# Altium schematic sheet ESP32.SchDoc
size 431 x 279 mm; Author: Shivam Sharma; SheetNumber: 7; SheetTotal: 13
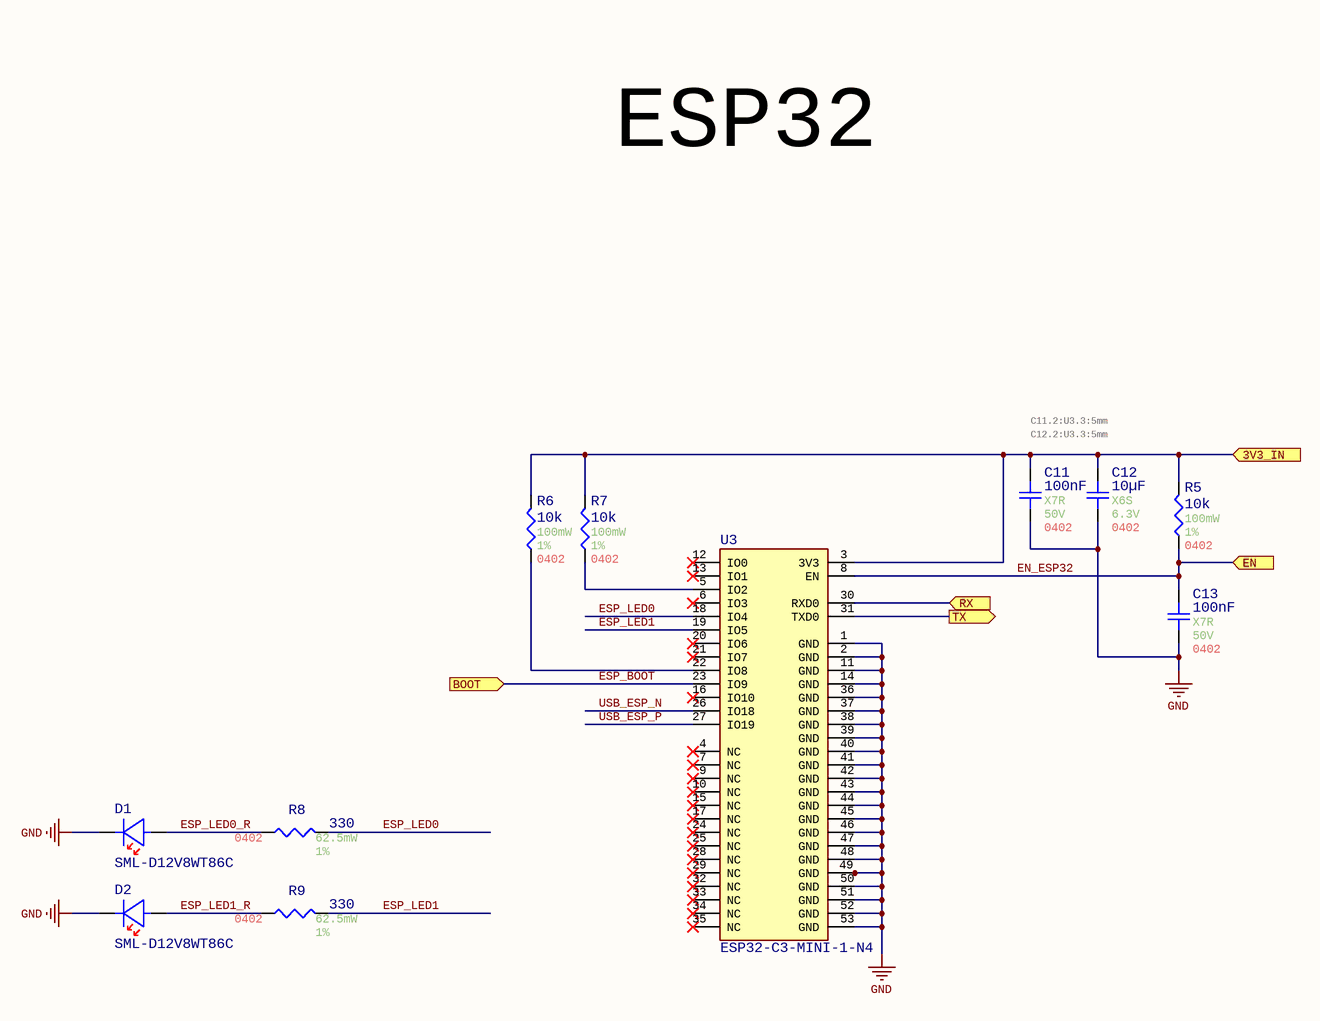
[diagram p0: ESP32.SchDoc]

## Parts
C11  value 100nF  Temperature Coefficient: X7R  Voltage Rating: 50V  Case/Package: 0402  PlaceNear: C11.2:U3.3:5mm  [Generic 0402 capacitor]  (hidden comment: GRT155R71H104KE01D)
C12  value 10µF  Temperature Coefficient: X6S  Voltage Rating: 6.3V  Case/Package: 0402  PlaceNear: C12.2:U3.3:5mm  [Generic 0402 capacitor]  (hidden comment: GRT155C80J106ME13J)
C13  value 100nF  Temperature Coefficient: X7R  Voltage Rating: 50V  Case/Package: 0402  [Generic 0402 capacitor]  (hidden comment: GRT155R71H104KE01D)
D1  SML-D12V8WT86C  [FP-SML-D12-MFG]
D2  SML-D12V8WT86C  [FP-SML-D12-MFG]
R5  value 10k  Power: 100mW  Tolerance: 1%  Case/Package: 0402  [Generic 0402 Resistor]  (hidden comment: RNCP0402FTD10K0)
R6  value 10k  Power: 100mW  Tolerance: 1%  Case/Package: 0402  [Generic 0402 Resistor]  (hidden comment: RNCP0402FTD10K0)
R7  value 10k  Power: 100mW  Tolerance: 1%  Case/Package: 0402  [Generic 0402 Resistor]  (hidden comment: RNCP0402FTD10K0)
R8  value 330  Power: 62.5mW  Tolerance: 1%  Case/Package: 0402  [Generic 0402 Resistor]  (hidden comment: RMCF0402FT330R)
R9  value 330  Power: 62.5mW  Tolerance: 1%  Case/Package: 0402  [Generic 0402 Resistor]  (hidden comment: RMCF0402FT330R)
U3  ESP32-C3-MINI-1-N4  [ESP32-C3-MINI-1-N4]

## Ports
3V3_IN (in), BOOT (in), EN (in), RX (in), TX (out)

## Nets
GND: C11.1 C12.1 C13.1 D1.1(C) D2.1(C) U3.1(GND) U3.2(GND) U3.11(GND) U3.14(GND) U3.36(GND) U3.37(GND) U3.38(GND) U3.39(GND) U3.40(GND) U3.41(GND) U3.42(GND) U3.43(GND) U3.44(GND) U3.45(GND) U3.46(GND) U3.47(GND) U3.48(GND) U3.49_1(GND) U3.49_2(GND) U3.49_3(GND) U3.49_4(GND) U3.49_5(GND) U3.49_6(GND) U3.49_7(GND) U3.49_8(GND) U3.49_9(GND) U3.50(GND) U3.51(GND) U3.52(GND) U3.53(GND)
3V3_IN: C11.2 C12.2 R5.2 R6.2 R7.2 U3.3(3V3) ; port 3V3_IN
EN_ESP32: C13.2 R5.1 U3.8(EN) ; port EN
ESP_BOOT: U3.23(IO9) ; port BOOT
ESP_LED0: R8.2 U3.18(IO4)
ESP_LED0_R: D1.2(A) R8.1
ESP_LED1: R9.2 U3.19(IO5)
ESP_LED1_R: D2.2(A) R9.1
RX: U3.30(RXD0) ; port RX
TX: U3.31(TXD0) ; port TX
USB_ESP_N: U3.26(IO18)
USB_ESP_P: U3.27(IO19)
NetR6_1: R6.1 U3.22(IO8)
NetR7_1: R7.1 U3.5(IO2)

Not connected (* = marked no-connect by the designer): U3 4(NC)* 6(IO3)* 7(NC)* 9(NC)* 10(NC)* 12(IO0)* 13(IO1)* 15(NC)* 16(IO10)* 17(NC)* 20(IO6)* 21(IO7)* 24(NC)* 25(NC)* 28(NC)* 29(NC)* 32(NC)* 33(NC)* 34(NC)* 35(NC)*

## Notes on the sheet
- ESP32
- Title:
- Author:
- Approved:
- Size:
- Date:
- Git Hash:
- Sch Revision:
- B
- Prj:
- SCH PN:
- Variant:
- Edited:
- CONFIDENTIAL
- File:
- (in symbol CMP-020-00031-1) 49

## Library data of the parts
C11 C13 = CMP-001-00084-12: Ceramic Capacitor, Multilayer, Ceramic, 50V, 10% +Tol, 10% -Tol, X7R, 15% TC, 0.1uF, Surface Mount, 0402; AECQ: Yes; Reach SVHC Compliant: Yes; Mounting Technology: Surface Mount; Termination: Wraparound; Pins: 2; Packaging: Tape and Reel; Package Shape: Rectangular; Multilayer: Yes; Tolerance: 10%; Max Operating Temperature: 125°C; Terminal Finish: Nickel; Capacitor Type: Ceramic; Dielectric Material: Ceramic; Min Operating Temperature: -55°C; RoHS Compliant: Yes
C12 = CMP-001-00108-2: Multilayer Ceramic Capacitors MLCC - SMD/SMT 0402 10uF 6.3VDC 20% X6S AEC-Q200; AECQ: Yes; Mounting Technology: Surface Mount; Max Operating Temperature: 105°C; Min Operating Temperature: -55°C; Tolerance: 20%; Pins: 2; RoHS Compliant: Yes; Capacitor Type: Ceramic
D1 D2 = CMP-007-00036-1: Red 630nm LED Indication - Discrete 2.2V 0603 (1608 Metric); Case/Package: 0603; Forward Voltage: 2.2V; Colour: Red; Pins: 2
R5-R7 = CMP-009-00242-1: Fixed Resistor, Thin Film, 0.1W, 10000ohm, 50V, 1% +/-Tol, 100ppm/Cel, Surface Mount, 0402; Manufacturer Part Number: Blank; AECQ: Yes; Pins: 2; Max Operating Temperature: 155°C; Voltage Rating: 50V; Mounting Technology: SMD; Min Operating Temperature: -55°C
R8 R9 = CMP-009-00225-1: Res Thick Film 0402 330 Ohm 1% 0.063W ±100ppm/°C Molded SMD Paper T/R; AECQ: Yes; Mounting Technology: Surface Mount; Max Operating Temperature: 155°C; RoHS Compliant: Yes; Pins: 2; Min Operating Temperature: -55°C
U3 = CMP-020-00031-1: Module; Wi-Fi/Bluetooth; transceiver; 4MB FLASH/PSRAM/400KB SRAM/384KB ROM; 3.0-3.6V; 13.2x16.6x2.4mm; Min Supply Voltage: 3V; Frequency: 160MHz; Max Supply Voltage: 3.6V; RoHS Compliant: Yes; Max Operating Temperature: 85°C; Case/Package: 53-SMD Module; Min Operating Temperature: -40°C